# EAGLE schematic WaterLevelSensor (EAGLE 9.6.2)
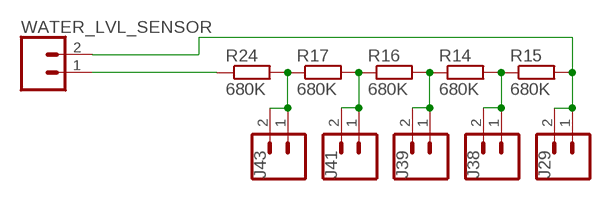
[diagram p0: schematic, sheet 1]

## Parts
J29  CONN_02_NO_SILK  [1X02_NO_SILK]
J38  CONN_02_NO_SILK  [1X02_NO_SILK]
J39  CONN_02_NO_SILK  [1X02_NO_SILK]
J41  CONN_02_NO_SILK  [1X02_NO_SILK]
J43  CONN_02_NO_SILK  [1X02_NO_SILK]
R14  680K  R-EU_R0805  [R0805]
R15  680K  R-EU_R0805  [R0805]
R16  680K  R-EU_R0805  [R0805]
R17  680K  R-EU_R0805  [R0805]
R24  680K  R-EU_R0805  [R0805]
WATER_LVL_SENSOR  CONN_02_NO_SILKPADS  [1X02_PADS]

## Nets
W1: J38.1 J38.2 R14.2 R15.1
W2: J39.1 J39.2 R14.1 R16.2
W3: J41.1 J41.2 R16.1 R17.2
W4: J43.1 J43.2 R17.1 R24.2
WLS+: J29.1 J29.2 R15.2 WATER_LVL_SENSOR.2
WLS-: R24.1 WATER_LVL_SENSOR.1

## Library data of the parts
J29 J38 J39 J41 J43 WATER_LVL_SENSOR = my-connectors:CONN_02_NO_SILK
R14-R17 R24 = rcl:R-EU_: RESISTOR, European symbol; SPICEPREFIX: R